# Altium project MOTOR_DRIVER.PrjPcb (part 2 of 2)

## Sheet 3_MOTORES_DC.SchDoc
size Tabloid; SheetNumber: 3; SheetTotal: 5; SPICEModelCacheNJINFHSP: <root> / <DocumentId>NJINFHSP</DocumentId> / <CacheFrame Number="0"> / <Model Name="0603_885012206023_330nf" Kind="CKT"> / <Text>******* / .subckt 0603_885012206023_330nF 1 2 / Rser 1 3 0.0113479919005 / Lser 2 4 4.48567636E-10 / C1 3 4 0.00000033 / Rpar 3 4 1500000000 / .ends 0603_885012206023_330nF</Text> / </Model> / <Model Name="0603_885012206121_330nf" Kind="CKT"> / <Text>******* / .subckt 0603_885012206121_330nF 1 2 / Rser 1 3 0.0116331902783 / Lser 2 4 2.98906197E-10 / C1 3 4 0.00000033 / Rpar 3 4 1500000000 / .ends 0603_885012206121_330nF</Text> / </Model> / <Model Name="0603_885012206008_1nf" Kind="CKT"> / <Text>******* / .subckt 0603_885012206008_1nF 1 2 / Rser 1 3 0.24958 / Lser 2 4 0.00000000040399 / C1 3 4 0.000000001 / Rpar 3 4 10000000000 / .ends 0603_885012206008_1nF</Text> / </Model> / <Model Name="0603_885012206014_10nf" Kind="CKT"> / <Text>******* / .subckt 0603_885012206014_10nF 1 2 / Rser 1 3 0.04641 / Lser 2 4 0.00000000025735 / C1 3 4 0.00000001 / Rpar 3 4 10000000000 / .ends 0603_885012206014_10nF</Text> / </Model> / <Model Name="865080649011_33uf" Kind="CKT"> / <Text>******* / .subckt 865080649011_33uF 1 2 / Rser 1 3 0.64 / Lser 2 4 0.000000003917 / C1 3 4 0.000033 / Rpar 3 4 3030303.03030303 / .ends 865080649011_33uF</Text> / </Model> / </CacheFrame> / </root>
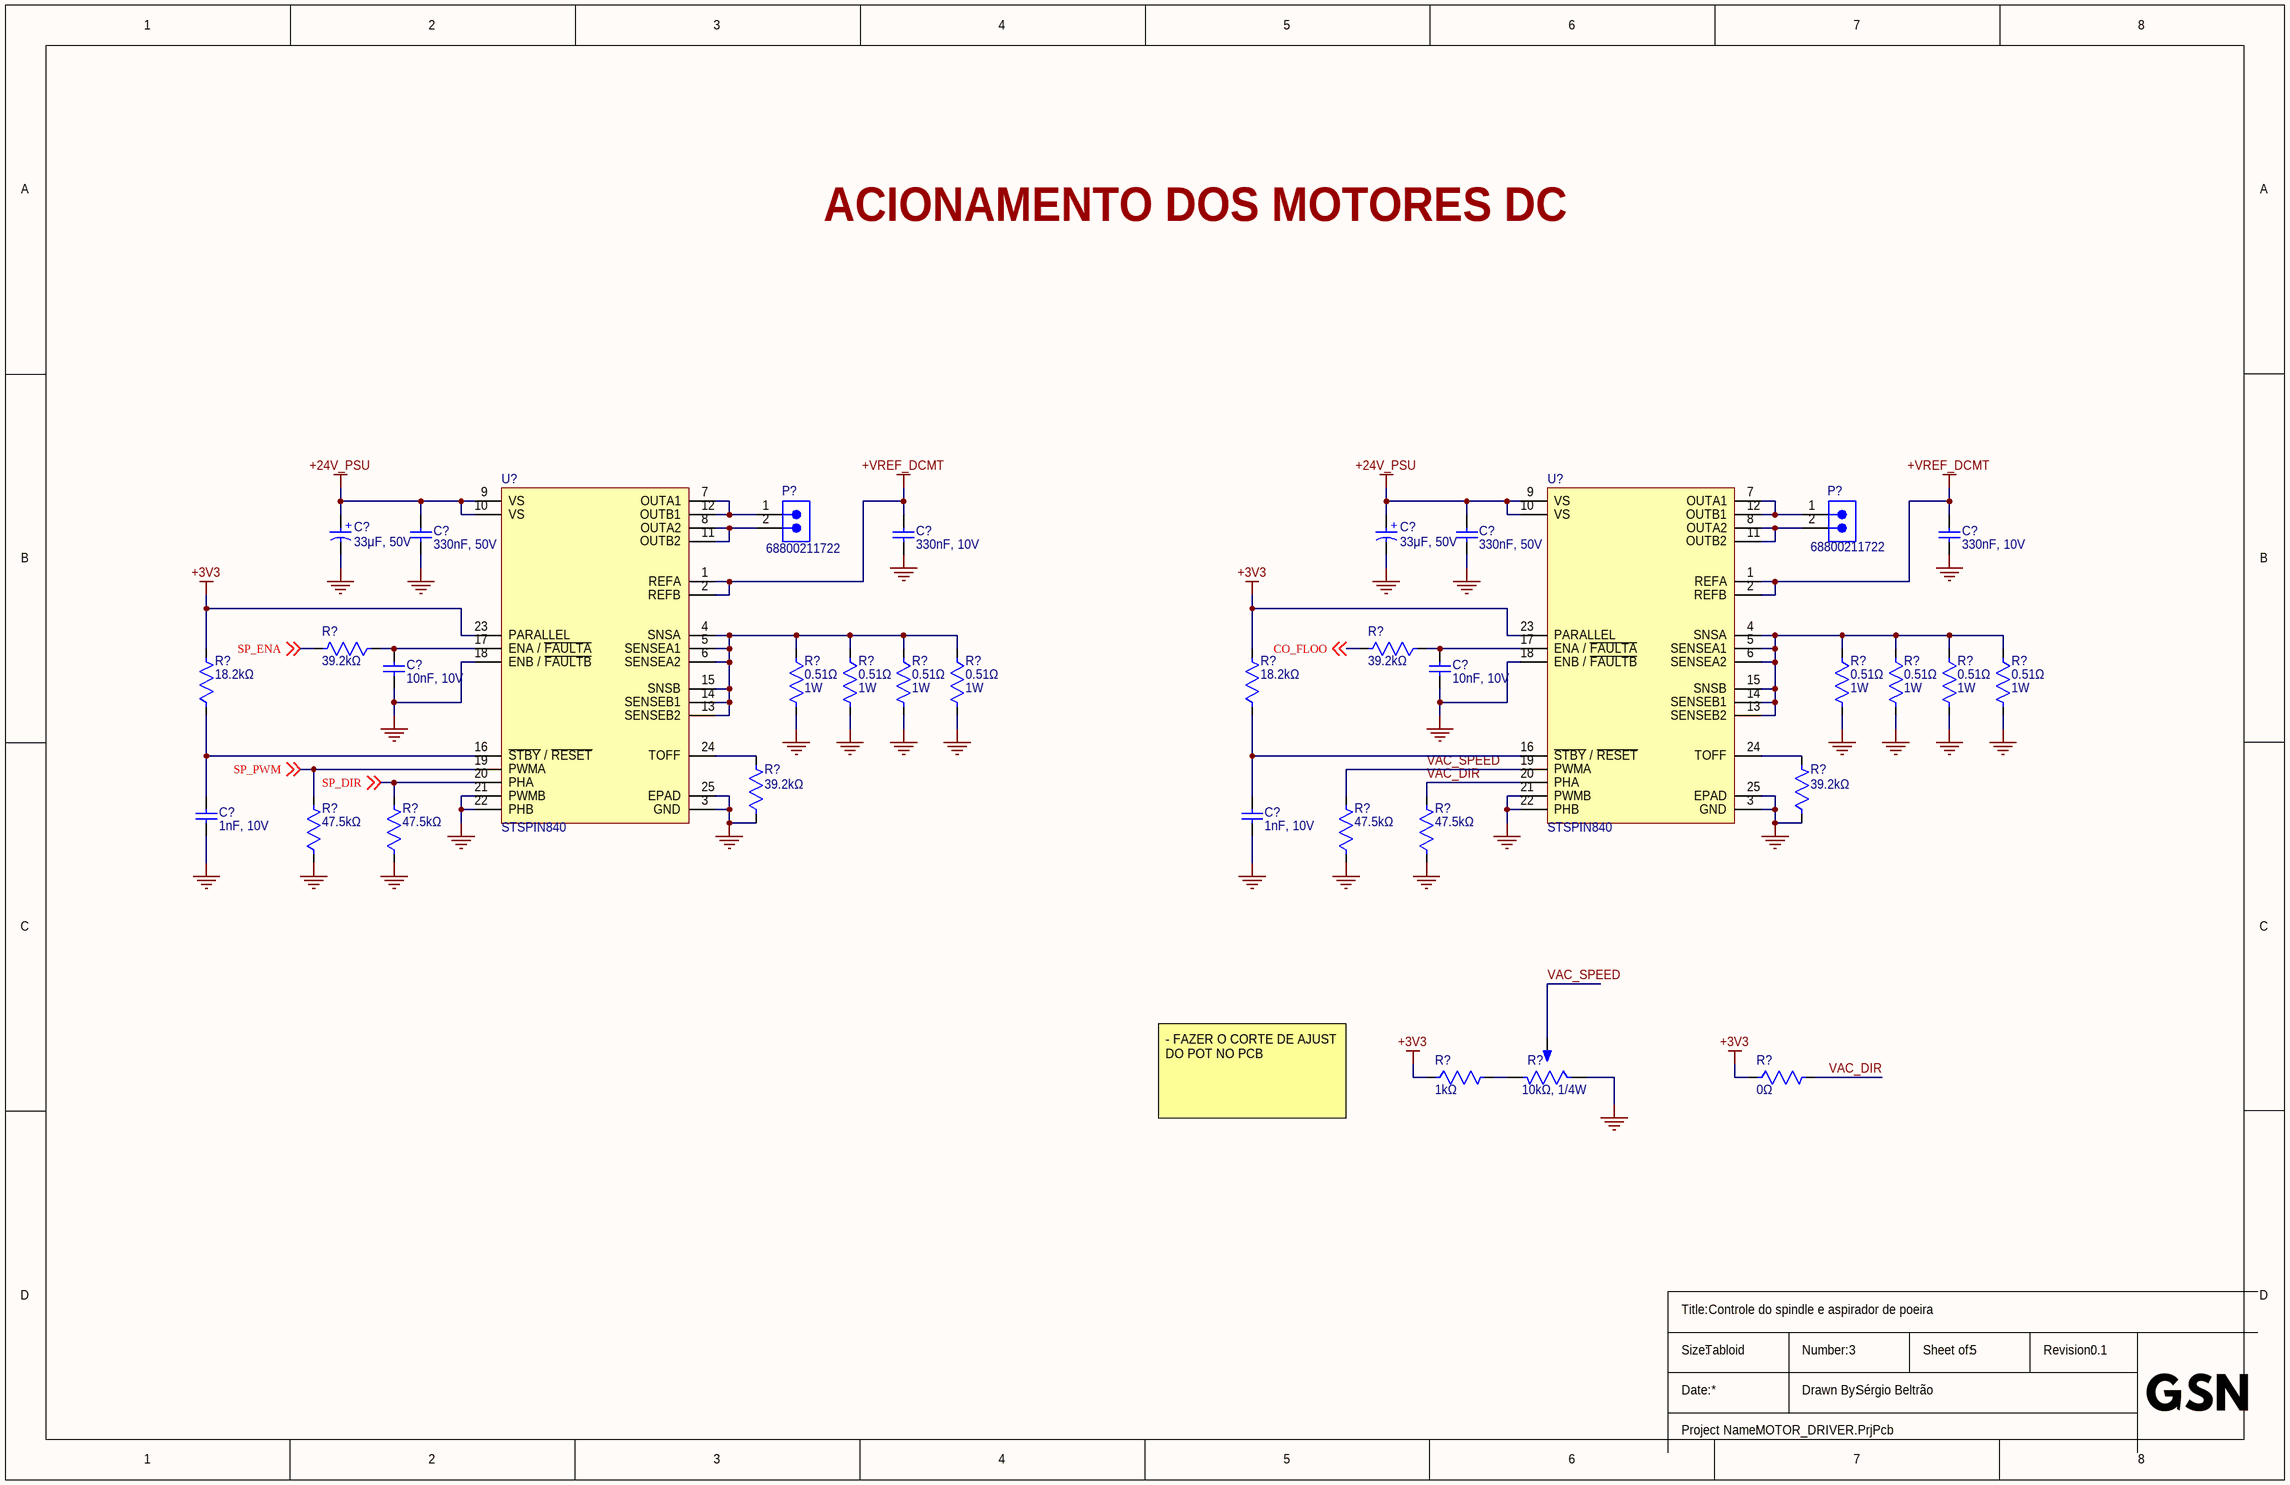
[diagram p2: 3_MOTORES_DC.SchDoc]

### Parts
(Parts that share a designator on the sheet are numbered #1, #2 ... from top to bottom, then left to right.)
C?#21  33μF, 50V  [WCAP-ASLI_D8H6.5]
C?#22  33μF, 50V  [WCAP-ASLI_D8H6.5]
C?#23  330nF, 50V  [WCAP-CSGP_0603_L1.6W0.8H0.8_Reflow]
C?#24  330nF, 10V  [WCAP-CSGP_0603_L1.6W0.8H0.8_Reflow]
C?#25  330nF, 50V  [WCAP-CSGP_0603_L1.6W0.8H0.8_Reflow]
C?#26  330nF, 10V  [WCAP-CSGP_0603_L1.6W0.8H0.8_Reflow]
C?#27  10nF, 10V  [WCAP-CSGP_0603_L1.6W0.8H0.8_Reflow]
C?#28  10nF, 10V  [WCAP-CSGP_0603_L1.6W0.8H0.8_Reflow]
C?#29  1nF, 10V  [WCAP-CSGP_0603_L1.6W0.8H0.8_Reflow]
C?#30  1nF, 10V  [WCAP-CSGP_0603_L1.6W0.8H0.8_Reflow]
P?#10  68800211722  [68800211722]
P?#11  68800211722  [68800211722]
R?#43  39.2kΩ  [0603-REFLOW]
R?#44  0.51Ω  Power Rating: 1W  [2010-REFLOW]
R?#45  0.51Ω  Power Rating: 1W  [2010-REFLOW]
R?#46  0.51Ω  Power Rating: 1W  [2010-REFLOW]
R?#47  0.51Ω  Power Rating: 1W  [2010-REFLOW]
R?#48  39.2kΩ  [0603-REFLOW]
R?#49  0.51Ω  Power Rating: 1W  [2010-REFLOW]
R?#50  0.51Ω  Power Rating: 1W  [2010-REFLOW]
R?#51  0.51Ω  Power Rating: 1W  [2010-REFLOW]
R?#52  0.51Ω  Power Rating: 1W  [2010-REFLOW]
R?#53  18.2kΩ  [0603-REFLOW]
R?#54  18.2kΩ  [0603-REFLOW]
R?#55  39.2kΩ  [0603-REFLOW]
R?#56  39.2kΩ  [0603-REFLOW]
R?#57  47.5kΩ  [0603-REFLOW]
R?#58  47.5kΩ  [0603-REFLOW]
R?#59  47.5kΩ  [0603-REFLOW]
R?#60  47.5kΩ  [0603-REFLOW]
R?#61  1kΩ  [0603-REFLOW]
R?#62  10kΩ, 1/4W  [TRIM-3224W]
R?#63  0Ω  [0603-REFLOW]
U?#7  STSPIN840  [24-TQFPN]
U?#8  STSPIN840  [24-TQFPN]

### Nets
+3V3: R?#53.2 R?#54.2 R?#61.1 R?#63.1 U?#7.23(PARALLEL) U?#8.23(PARALLEL)
+24V_PSU: C?#21.1(P) C?#22.1(P) C?#23.2 C?#25.2 U?#7.9(VS) U?#7.10(VS) U?#8.9(VS) U?#8.10(VS)
+VREF_DCMT: C?#24.2 C?#26.2 U?#7.1(REFA) U?#7.2(REFB) U?#8.1(REFA) U?#8.2(REFB)
GND: C?#21.2(N) C?#22.2(N) C?#23.1 C?#24.1 C?#25.1 C?#26.1 C?#27.1 C?#28.1 C?#29.1 C?#30.1 R?#44.2 R?#45.2 R?#46.2 R?#47.2 R?#49.2 R?#50.2 R?#51.2 R?#52.2 R?#55.1 R?#56.1 R?#57.1 R?#58.1 R?#59.1 R?#60.1 R?#62.1(CCW) U?#7.3(GND) U?#7.18(ENB_/_~{FAULTB}) U?#7.21(PWMB) U?#7.22(PHB) U?#7.25(EPAD) U?#8.3(GND) U?#8.18(ENB_/_~{FAULTB}) U?#8.21(PWMB) U?#8.22(PHB) U?#8.25(EPAD)
CO_FLOO: R?#48.2 ; off-sheet CO_FLOO
SP_DIR: R?#58.2 U?#7.20(PHA) ; off-sheet SP_DIR
SP_ENA: R?#43.2 ; off-sheet SP_ENA
SP_PWM: R?#57.2 U?#7.19(PWMA) ; off-sheet SP_PWM
VAC_DIR: R?#60.2 R?#63.2 U?#8.20(PHA)
VAC_SPEED: R?#59.2 R?#62.2(WIPER) U?#8.19(PWMA)
NetC?#27_2: C?#27.2 R?#43.1 U?#7.17(ENA_/_~{FAULTA})
NetC?#28_2: C?#28.2 R?#48.1 U?#8.17(ENA_/_~{FAULTA})
NetC?#29_2: C?#29.2 R?#53.1 U?#7.16(~{STBY}_/_~{RESET})
NetC?#30_2: C?#30.2 R?#54.1 U?#8.16(~{STBY}_/_~{RESET})
NetP?#10_1: P?#10.1 U?#7.7(OUTA1) U?#7.12(OUTB1)
NetP?#10_2: P?#10.2 U?#7.8(OUTA2) U?#7.11(OUTB2)
NetP?#11_1: P?#11.1 U?#8.7(OUTA1) U?#8.12(OUTB1)
NetP?#11_2: P?#11.2 U?#8.8(OUTA2) U?#8.11(OUTB2)
NetR?#44_1: R?#44.1 R?#45.1 R?#46.1 R?#47.1 U?#7.4(SNSA) U?#7.5(SENSEA1) U?#7.6(SENSEA2) U?#7.13(SENSEB2) U?#7.14(SENSEB1) U?#7.15(SNSB)
NetR?#49_1: R?#49.1 R?#50.1 R?#51.1 R?#52.1 U?#8.4(SNSA) U?#8.5(SENSEA1) U?#8.6(SENSEA2) U?#8.13(SENSEB2) U?#8.14(SENSEB1) U?#8.15(SNSB)
NetR?#55_2: R?#55.2 U?#7.24(TOFF)
NetR?#56_2: R?#56.2 U?#8.24(TOFF)
NetR?#61_2: R?#61.2 R?#62.3(CW)

### Notes on the sheet
- ACIONAMENTO DOS MOTORES DC
- - FAZER O CORTE DE AJUST DO POT NO PCB
- Controle do spindle e aspirador de poeira
- Title:
- Size:
- Tabloid
- Number:
- Sheet of:
- Revision:
- Date:
- Project Name:
- Drawn By:
- (in symbol 865080649011) +

### Library data of the parts
C?#21 C?#22 = 865080649011: WCAP-ASLI Aluminum Electrolytic Capacitor, V-Chip, SMT, 8mm x 6.5mm, 33μF, 50V; Manufacturer: Wurth Elektronik; Capacitance: 33uF; Dissipation Factor: 12%; Endurance: 2000h; Impedance: 700mohm; Leakage Current: 16.5uA; Ripple Current: 200mA; Manufacturer Part Number: 865080649011; Category: Aluminum Electrolytic Capacitors; Match Code: WCAP-ASLI; ComponentLink1Description: Website Link; ComponentLink1URL: https://www.we-online.com/redexpert/article/865080649011?ad; ComponentLink2Description: Datasheet Link; ComponentLink2URL: https://www.we-online.com/redexpert/spec/865080649011?ad; Mount: Surface Mount; Operating Temperature Min: -55degC; Operating Temperature Max: 105degC; Packaging: Tape and Reel; Height: 6.5mm; Diameter: 8mm; Rated Voltage (DC): 50V
C?#23 C?#25 = 885012206121: WCAP-CSGP Multilayer Ceramic Chip Capacitor, General Purpose, size 0603, 330nF, 50V; Manufacturer: Wurth Elektronik; Case/Size Code: 0603; Capacitance Tolerance: +/-10%; Ceramic Type: X7R; Dissipation Factor: 10%; Insulation Resistance: 1.5GΩ; Technical Reference: X7R0603334K050DFCT10000; Manufacturer Part Number: 885012206121; Category: Multilayer Ceramic Chip Capacitors; Match Code: WCAP-CSGP; ComponentLink1Description: Website Link; ComponentLink1URL: https://www.we-online.com/redexpert/article/885012206121?ad; ComponentLink2Description: Datasheet Link; ComponentLink2URL: https://www.we-online.com/redexpert/spec/885012206121?ad; Mount: Surface Mount; Min Operating Temperature: -55°C; Max Operating Temperature: 125°C; Packaging: Tape and Reel; Length: 1.6mm; Width: 0.8mm; Height: 0.8mm; Capacitance: 330nF; Rated Voltage (DC): 50V
C?#24 C?#26 = 885012206023: WCAP-CSGP Multilayer Ceramic Chip Capacitor, General Purpose, size 0603, 330nF, 10V; Manufacturer: Wurth Elektronik; Case/Size Code: 0603; Capacitance Tolerance: +/-10%; Ceramic Type: X7R; Dissipation Factor: 10%; Insulation Resistance: 1.5GΩ; Technical Reference: X7R0603334K010DFCT10000; Manufacturer Part Number: 885012206023; Category: Multilayer Ceramic Chip Capacitors; Match Code: WCAP-CSGP; ComponentLink1Description: Website Link; ComponentLink1URL: https://www.we-online.com/redexpert/article/885012206023?ad; ComponentLink2Description: Datasheet Link; ComponentLink2URL: https://www.we-online.com/redexpert/spec/885012206023?ad; Mount: Surface Mount; Min Operating Temperature: -55°C; Max Operating Temperature: 125°C; Packaging: Tape and Reel; Length: 1.6mm; Width: 0.8mm; Height: 0.8mm; Capacitance: 330nF; Rated Voltage (DC): 10V
C?#27 C?#28 = 885012206014: WCAP-CSGP Multilayer Ceramic Chip Capacitor, General Purpose, size 0603, 10nF, 10V; Manufacturer: Wurth Elektronik; Case/Size Code: 0603; Capacitance Tolerance: +/-10%; Ceramic Type: X7R; Dissipation Factor: 5%; Insulation Resistance: 10GΩ; Technical Reference: X7R0603103K010DFCT10000; Manufacturer Part Number: 885012206014; Category: Multilayer Ceramic Chip Capacitors; Match Code: WCAP-CSGP; ComponentLink1Description: Website Link; ComponentLink1URL: https://www.we-online.com/redexpert/article/885012206014?ad; ComponentLink2Description: Datasheet Link; ComponentLink2URL: https://www.we-online.com/redexpert/spec/885012206014?ad; Mount: Surface Mount; Min Operating Temperature: -55°C; Max Operating Temperature: 125°C; Packaging: Tape and Reel; Length: 1.6mm; Width: 0.8mm; Height: 0.8mm; Capacitance: 10nF; Rated Voltage (DC): 10V
C?#29 C?#30 = 885012206008: WCAP-CSGP Multilayer Ceramic Chip Capacitor, General Purpose, size 0603, 1nF, 10V; Manufacturer: Wurth Elektronik; Case/Size Code: 0603; Capacitance Tolerance: +/-10%; Ceramic Type: X7R; Dissipation Factor: 5%; Insulation Resistance: 10GΩ; Technical Reference: X7R0603102K010DFCT10000; Manufacturer Part Number: 885012206008; Category: Multilayer Ceramic Chip Capacitors; Match Code: WCAP-CSGP; ComponentLink1Description: Website Link; ComponentLink1URL: https://www.we-online.com/redexpert/article/885012206008?ad; ComponentLink2Description: Datasheet Link; ComponentLink2URL: https://www.we-online.com/redexpert/spec/885012206008?ad; Mount: Surface Mount; Min Operating Temperature: -55°C; Max Operating Temperature: 125°C; Packaging: Tape and Reel; Length: 1.6mm; Width: 0.8mm; Height: 0.8mm; Capacitance: 1nF; Rated Voltage (DC): 10V
P?#10 P?#11 = 68800211722: WR-WTB “J” Type THT Male Horizontal Shrouded Header, pitch 2.5 mm, 2 pins; Manufacturer: Wurth Elektronik; Contact Resistance: 20 mohm; Rated Current: 3 A; Working Voltage: 250 V(AC); Withstanding Voltage: 800 V(AC); Manufacturer Part Number: 68800211722; Category: Wire-to-Board Connector; Match Code: WR-WTB; ComponentLink1Description: Website Link; ComponentLink1URL: https://www.we-online.com/redexpert/article/68800211722?ad; ComponentLink2Description: Datasheet Link; ComponentLink2URL: https://www.we-online.com/redexpert/spec/68800211722?ad; Mount: Through Hole; Operating Temperature Min: -25degC; Operating Temperature Max: 85degC; Packaging: Bag; Length: 7.5 mm; Width: 8.3 mm; Height: 4.2 mm; Gender: Male; Number of Pins: 2; Number of Rows: 1; Orientation: Horizontal; Lead Pitch: 2.5 mm
R?#43 R?#48 R?#55 R?#56 = RC0603FR-0739K2L: RES 39.2K OHM 1% 1/10W 0603; Manufacturer: Yageo Group; Max Power Dissipation: 100mW; Temperature Coefficient: ±200ppm/°C; Voltage Rating (AC): 50V; Voltage Rating: 75V; Supplier Part Number: 311-39.2KHRCT-ND; Manufacturer Part Number: RC0603FR-0739K2L; Value: 39.2kΩ; Case Code (Imperial): 0603; Case Code (Metric): 1608; Case/Package: 0603; Category: Chip SMD Resistors; China RoHS: Non-Compliant; Composition: Thick Film; Contact Plating: Tin; Depth: 800µm; Features: Moisture Resistant; Height: 450µm; Lead Free: Lead Free; Length: 1.6mm; Lifecycle Status: Production; Max Operating Temperature: 155°C; Military Standard: Not; Min Operating Temperature: -55°C; Mounting Technology: Surface Mount; Number of Terminals: 2; Number of Terminations: 2; Packaging: Tape & Reel; Power Dissipation: 100mW; Power Rating: 100mW; Radiation Hardening: No; REACH SVHC: Yes; RoHS: Compliant; Supplier: DigiKey; Termination: SMD/SMT; Tolerance: 1%; Component Link Description: https://www.yageogroup.com/content/datasheet/asset/file/PYU-RC_GROUP_51_ROHS_L; Component Link URL: https://www.yageogroup.com/content/datasheet/asset/file/PYU-RC_GROUP_51_ROHS_L; Datasheet: https://www.yageogroup.com/content/datasheet/asset/file/PYU-RC_GROUP_51_ROHS_L; Voltage Rating (DC): 50V; Weight: 2.012816mg; Width: 800µm; Working Voltage: 75V
R?#44-R?#47 R?#49-R?#52 = RCWE2010R510FKEA: RES 0.51 OHM 1% 1W 2010; Manufacturer: Vishay; Value: 510mΩ; Temperature Coefficient: 100ppm/°C; Working Voltage: 714.1mV; Supplier: DigiKey; Supplier Part Number: RCWE.51GCT-ND; Manufacturer Part Number: RCWE2010R510FKEA; RoHS: Compliant; Category: Chip SMD Resistors; Stock: 6435; Pricing: 1=0.65, 10=0.417, 25=0.3544, 50=0.3156, 100=0.2824, 250=0.24596, 500=0.22314, 1000=0.20376 (USD); Case/Package: 2010; Case Code (Imperial): 2010; Case Code (Metric): 5025; China RoHS: Non-Compliant; Composition: Thick Film; Contact Plating: Tin; Features: Automotive AEC-Q200, Moisture Resistant; Height: 600µm; Length: 5.0038mm; Lifecycle Status: Production; Max Operating Temperature: 155°C; Max Power Dissipation: 1W; Min Operating Temperature: -55°C; Mounting Technology: Surface Mount; Pins: 2; Number of Terminals: 2; Number of Terminations: 2; Power Dissipation: 1W; Radiation Hardening: No; REACH SVHC: Yes; Schedule B: 8533210045, 8533210045|8533210045|8533210045|8533210045|8533210045; Termination: SMD/SMT; Tolerance: 1%; Width: 2.5mm; ComponentLink1URL: https://datasheet.octopart.com:443/RCWE2010R510FKEA-Vishay-datasheet-170667730.pdf?src-supplier=IHS; ComponentLink1Description: https://datasheet.octopart.com:443/RCWE2010R510FKEA-Vishay-datasheet-170667730.pdf?src-supplier=IHS; ComponentLink2URL: https://datasheet.octopart.com:443/RCWE2010R510FKEA-Vishay-datasheet-78835242.pdf?src-supplier=Newark; ComponentLink2Description: https://datasheet.octopart.com:443/RCWE2010R510FKEA-Vishay-datasheet-78835242.pdf?src-supplier=Newark; ComponentLink3URL: https://datasheet.octopart.com:443/RCWE2010R510FKEA-Vishay-datasheet-10025643.pdf?src-supplier=element14+APAC; ComponentLink3Description: https://datasheet.octopart.com:443/RCWE2010R510FKEA-Vishay-datasheet-10025643.pdf?src-supplier=element14+APAC; ComponentLink4URL: http://sigma.octopart.com:80/rohs_statement/Vishay-company-15.pdf?src-supplier=Compliance+Statements; ComponentLink4Description: http://sigma.octopart.com:80/rohs_statement/Vishay-company-15.pdf?src-supplier=Compliance+Statements
R?#53 R?#54 = RC0603FR-0718K2L: RES 18.2K OHM 1% 1/10W 0603; Manufacturer: Yageo Group; Max Power Dissipation: 100mW; Temperature Coefficient: ±200ppm/°C; Voltage Rating (AC): 50V; Voltage Rating: 75V; Supplier Part Number: 311-18.2KHRCT-ND; Manufacturer Part Number: RC0603FR-0718K2L; Value: 18.2kΩ; Case Code (Imperial): 0603; Case Code (Metric): 1608; Case/Package: 0603; Category: Chip SMD Resistors; China RoHS: Non-Compliant; Composition: Thick Film; Contact Plating: Tin; Depth: 800µm; Features: Moisture Resistant; Height: 450µm; Lead Free: Lead Free; Length: 1.6mm; Lifecycle Status: Production; Max Operating Temperature: 155°C; Military Standard: Not; Min Operating Temperature: -55°C; Mounting Technology: Surface Mount; Number of Terminals: 2; Number of Terminations: 2; Packaging: Tape & Reel; Power Dissipation: 100mW; Power Rating: 100mW; Radiation Hardening: No; REACH SVHC: Yes; RoHS: Compliant; Supplier: DigiKey; Termination: SMD/SMT; Tolerance: 1%; Component Link Description: https://www.yageogroup.com/content/datasheet/asset/file/PYU-RC_GROUP_51_ROHS_L; Component Link URL: https://www.yageogroup.com/content/datasheet/asset/file/PYU-RC_GROUP_51_ROHS_L; Datasheet: https://www.yageogroup.com/content/datasheet/asset/file/PYU-RC_GROUP_51_ROHS_L; Voltage Rating (DC): 50V; Weight: 2.012816mg; Width: 800µm; Working Voltage: 75V
R?#57-R?#60 = RC0603FR-0747K5L: RES 47.5K OHM 1% 1/10W 0603; Manufacturer: Yageo Group; Max Power Dissipation: 100mW; Temperature Coefficient: ±200ppm/°C; Voltage Rating (AC): 50V; Voltage Rating: 75V; Supplier Part Number: 311-47.5KHRCT-ND; Manufacturer Part Number: RC0603FR-0747K5L; Value: 47.5kΩ; Case Code (Imperial): 0603; Case Code (Metric): 1608; Case/Package: 0603; Category: Chip SMD Resistors; China RoHS: Non-Compliant; Composition: Thick Film; Contact Plating: Tin; Depth: 800µm; Features: Moisture Resistant; Height: 450µm; Lead Free: Lead Free; Length: 1.6mm; Lifecycle Status: Production; Max Operating Temperature: 155°C; Military Standard: Not; Min Operating Temperature: -55°C; Mounting Technology: Surface Mount; Number of Terminals: 2; Number of Terminations: 2; Packaging: Tape & Reel; Power Dissipation: 100mW; Power Rating: 100mW; Radiation Hardening: No; REACH SVHC: Yes; RoHS: Compliant; Supplier: DigiKey; Termination: SMD/SMT; Tolerance: 1%; Component Link Description: https://www.yageogroup.com/content/datasheet/asset/file/PYU-RC_GROUP_51_ROHS_L; Component Link URL: https://www.yageogroup.com/content/datasheet/asset/file/PYU-RC_GROUP_51_ROHS_L; Datasheet: https://www.yageogroup.com/content/datasheet/asset/file/PYU-RC_GROUP_51_ROHS_L; Voltage Rating (DC): 50V; Weight: 2.012816mg; Width: 800µm; Working Voltage: 75V
R?#61 = RC0603FR-071KL: RES 1K OHM 1% 1/10W 0603; Manufacturer: Yageo Group; Max Power Dissipation: 100mW; Temperature Coefficient: ±200ppm/°C; Voltage Rating (AC): 50V; Voltage Rating: 75V; Supplier Part Number: 311-1.00KHRCT-ND; Manufacturer Part Number: RC0603FR-071KL; Value: 1kΩ; Case Code (Imperial): 0603; Case Code (Metric): 1608; Case/Package: 0603; Category: Chip SMD Resistors; China RoHS: Non-Compliant; Composition: Thick Film; Contact Plating: Tin; Depth: 800µm; Features: Moisture Resistant; Height: 450µm; Lead Free: Lead Free; Length: 1.6mm; Lifecycle Status: Production; Max Operating Temperature: 155°C; Military Standard: Not; Min Operating Temperature: -55°C; Mounting Technology: Surface Mount; Number of Terminals: 2; Number of Terminations: 2; Packaging: Tape & Reel; Power Dissipation: 100mW; Power Rating: 100mW; Radiation Hardening: No; REACH SVHC: Yes; RoHS: Compliant; Supplier: DigiKey; Termination: SMD/SMT; Tolerance: 1%; Component Link Description: https://www.yageogroup.com/content/datasheet/asset/file/PYU-RC_GROUP_51_ROHS_L; Component Link URL: https://www.yageogroup.com/content/datasheet/asset/file/PYU-RC_GROUP_51_ROHS_L; Datasheet: https://www.yageogroup.com/content/datasheet/asset/file/PYU-RC_GROUP_51_ROHS_L; Voltage Rating (DC): 50V; Weight: 2.012816mg; Width: 800µm; Working Voltage: 75V
R?#62 = 3224W-1-103G: TRIMMER 10K OHM 0.25W J LEAD TOP; Manufacturer: Bourns; Max Power Dissipation: 250mW; Number of Turns: 12; Temperature Coefficient: 100ppm/°C; Tolerance: 10%; Working Voltage: 300V; Supplier: DigiKey; Supplier Part Number: 3224W-1-103GCT-ND; Manufacturer Part Number: 3224W-1-103G; RoHS: Compliant; Category: Variable Resistors and Potentiometers; Stock: 792; Pricing: 1=3.93, 10=3.271, 25=3.038, 50=2.8722, 100=2.7147, 250=2.51884, 500=2.3796 (USD); Composition: Cermet; Depth: 3.9mm; Height: 5.1mm; Length: 4.8mm; Lifecycle Status: Production; Max Operating Temperature: 150°C; Military Standard: Not; Min Operating Temperature: -65°C; Mounting Technology: Surface Mount; Number of Terminals: 3; Packaging: Tape & Reel (TR); Power Rating: 250mW; REACH SVHC: No; Value: 10kΩ; Termination: SMD/SMT; Width: 3.5mm; ComponentLink1URL: https://datasheet.octopart.com:443/3224W-1-103G-Bourns-datasheet-182141393.pdf?src-supplier=IHS; ComponentLink1Description: https://datasheet.octopart.com:443/3224W-1-103G-Bourns-datasheet-182141393.pdf?src-supplier=IHS; ComponentLink2URL: https://datasheet.octopart.com:443/3224W-1-103G-Bourns-datasheet-156011607.pdf?src-supplier=element14+APAC; ComponentLink2Description: https://datasheet.octopart.com:443/3224W-1-103G-Bourns-datasheet-156011607.pdf?src-supplier=element14+APAC; ComponentLink3URL: https://datasheet.octopart.com:443/3224W-1-103G-Bourns-datasheet-64275176.pdf?src-supplier=Master+Electronics; ComponentLink3Description: https://datasheet.octopart.com:443/3224W-1-103G-Bourns-datasheet-64275176.pdf?src-supplier=Master+Electronics; ComponentLink4URL: https://datasheet.octopart.com:443/3224W-1-103G-Bourns-datasheet-11533694.pdf?src-supplier=Arrow+Electronics; ComponentLink4Description: https://datasheet.octopart.com:443/3224W-1-103G-Bourns-datasheet-11533694.pdf?src-supplier=Arrow+Electronics; ComponentLink5URL: http://sigma.octopart.com:80/conflict_mineral_statement/Bourns-company-36.pdf?src-supplier=Compliance+Statements; ComponentLink5Description: http://sigma.octopart.com:80/conflict_mineral_statement/Bourns-company-36.pdf?src-supplier=Compliance+Statements
R?#63 = RC0603FR-070RL: RES 0 OHM 1% 1/10W 0603; Manufacturer: Yageo Group; Max Power Dissipation: 100mW; Temperature Coefficient: ±200ppm/°C; Voltage Rating (AC): 50V; Voltage Rating: 75V; Supplier Part Number: 311-0.0HRCT-ND; Manufacturer Part Number: RC0603FR-070RL; Value: 0Ω; Case Code (Imperial): 0603; Case Code (Metric): 1608; Case/Package: 0603; Category: Chip SMD Resistors; China RoHS: Non-Compliant; Composition: Thick Film; Contact Plating: Tin; Depth: 800µm; Features: Moisture Resistant; Height: 450µm; Lead Free: Lead Free; Length: 1.6mm; Lifecycle Status: Production; Max Operating Temperature: 155°C; Military Standard: Not; Min Operating Temperature: -55°C; Mounting Technology: Surface Mount; Number of Terminals: 2; Number of Terminations: 2; Packaging: Tape & Reel; Power Dissipation: 100mW; Power Rating: 100mW; Radiation Hardening: No; REACH SVHC: Yes; RoHS: Compliant; Supplier: DigiKey; Termination: SMD/SMT; Tolerance: 1%; Component Link Description: https://www.yageogroup.com/content/datasheet/asset/file/PYU-RC_GROUP_51_ROHS_L; Component Link URL: https://www.yageogroup.com/content/datasheet/asset/file/PYU-RC_GROUP_51_ROHS_L; Datasheet: https://www.yageogroup.com/content/datasheet/asset/file/PYU-RC_GROUP_51_ROHS_L; Voltage Rating (DC): 50V; Weight: 2.012816mg; Width: 800µm; Working Voltage: 75V
U?#7 U?#8 = STSPIN840: IC MOTOR DRIVER 7V-45V 24TQFPN; Manufacturer: STMicroelectronics; Drain to Source Resistance: 500mΩ; Interface: Parallel; Max Output current: 1.5A; Max Supply Voltage: 45V; Min Supply Voltage: 7V; Number of Circuits: 1; Operating Supply Voltage: 36V; Output Voltage: 48V; Supplier: DigiKey; Supplier Part Number: 497-18119-1-ND; Manufacturer Part Number: STSPIN840; RoHS: Compliant; Category: Motor Drivers; Stock: 9342; Pricing: 1=2.95, 10=2.208, 25=2.022, 100=1.8174, 250=1.71984, 500=1.66102, 1000=1.61261 (USD); China RoHS: Compliant; Height - Seated (Max): 1.1mm; Length: 4mm; Lifecycle Status: Production; Max Operating Temperature: 150°C; Min Operating Temperature: -40°C; Number of Terminals: 24; Output Current: 1.5A; REACH SVHC: Yes; Schedule B: 8542390000, 8542390000|8542390000|8542390000|8542390000|8542390000; Terminal Pitch: 500µm; Width: 4mm; ComponentLink1URL: https://datasheet.octopart.com:443/STSPIN840-STMicroelectronics-datasheet-116891059.pdf?src-supplier=ODG+(Origin+Data+Global); ComponentLink1Description: https://datasheet.octopart.com:443/STSPIN840-STMicroelectronics-datasheet-116891059.pdf?src-supplier=ODG+(Origin+Data+Global)

## Sheet 5_IO_EXTERNOS.SchDoc
size Tabloid; SheetNumber: 4; SheetTotal: 4; SPICEModelCacheXJOKVXOX: <root> / <DocumentId>XJOKVXOX</DocumentId> / </root>
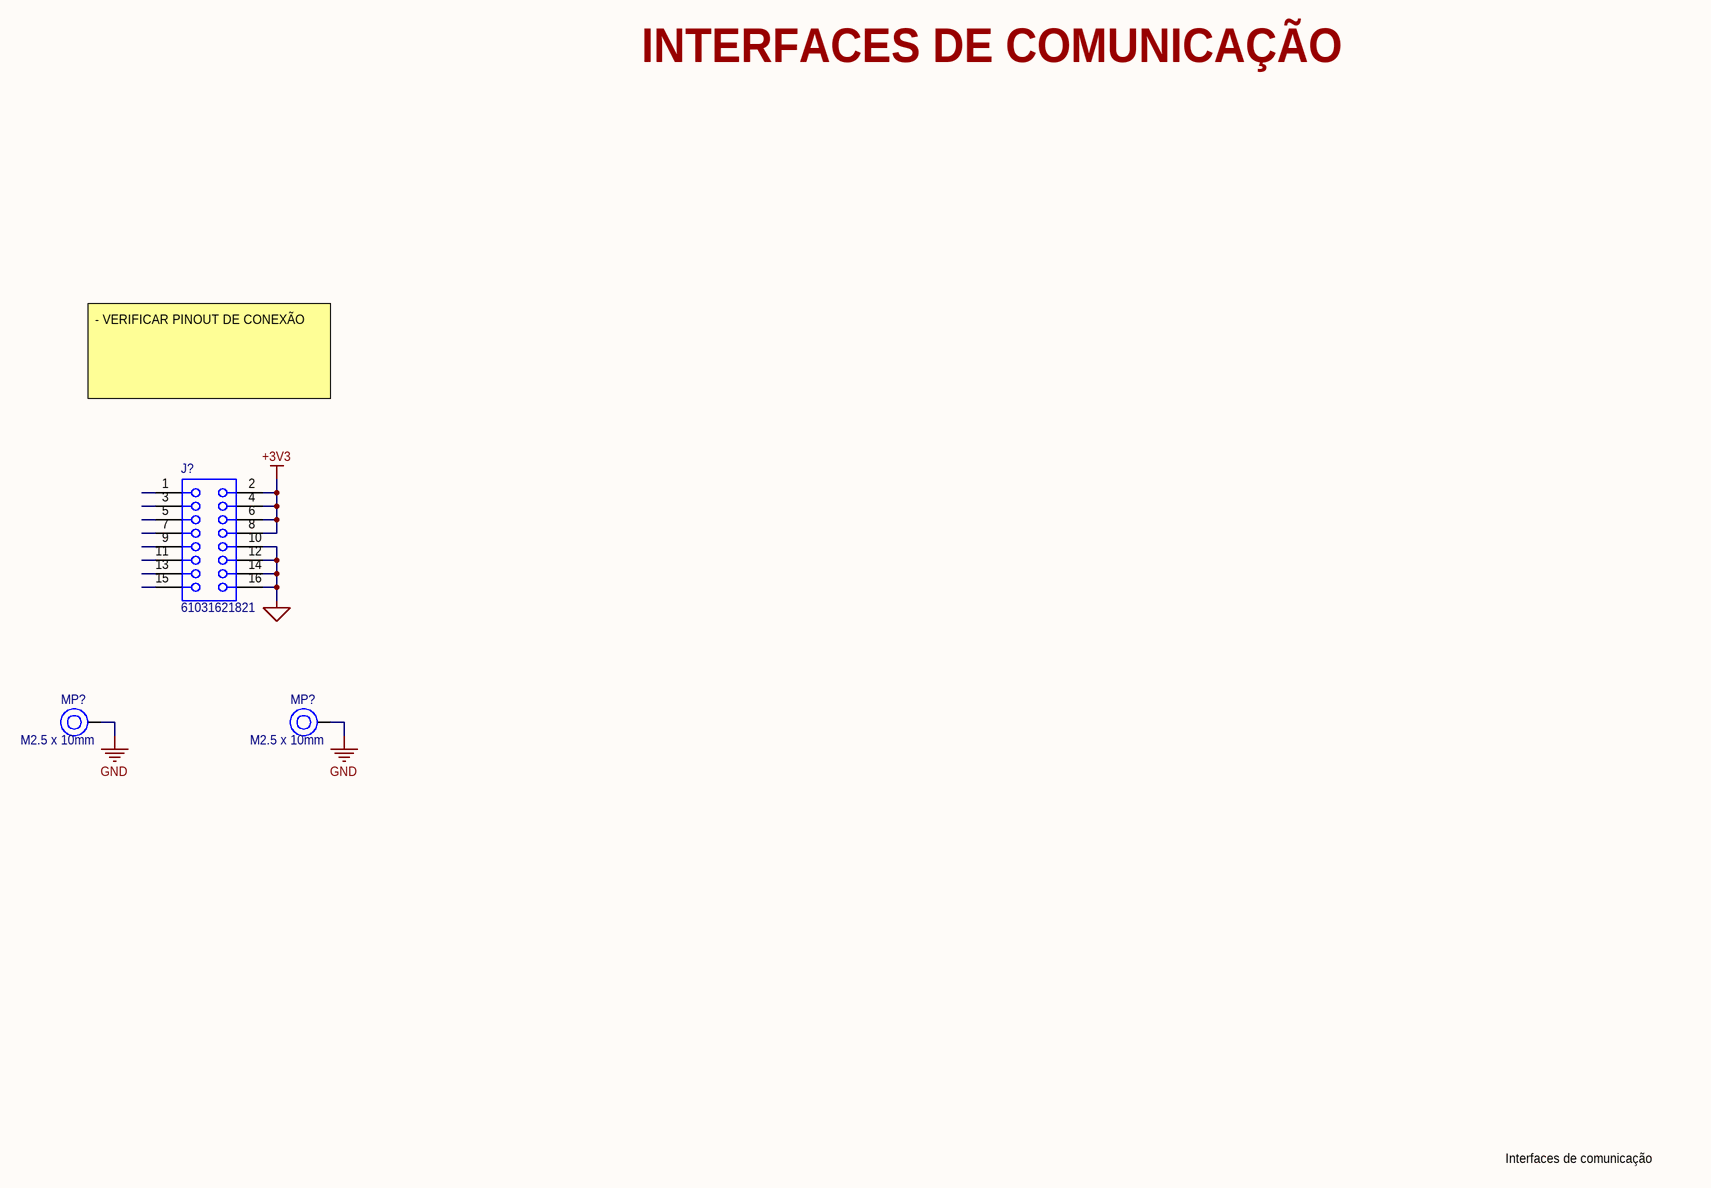
[diagram p3: 5_IO_EXTERNOS.SchDoc]

### Parts
(Parts that share a designator on the sheet are numbered #1, #2 ... from top to bottom, then left to right.)
J?#2  61031621821  [61031621821]
MP?#1  M2.5 x 10mm  [9774100151]
MP?#2  M2.5 x 10mm  [9774100151]

### Nets
+3V3: J?#2.2 J?#2.4 J?#2.6 J?#2.8
GND: MP?#1.1 MP?#2.1
GND_ISO: J?#2.10 J?#2.12 J?#2.14 J?#2.16

Not connected (* = marked no-connect by the designer): J?#2 1 3 5 7 9 11 13 15

### Notes on the sheet
- INTERFACES DE COMUNICAÇÃO
- - VERIFICAR PINOUT DE CONEXÃO
- Interfaces de comunicação
- Title:
- Size:
- Tabloid
- Number:
- Sheet of:
- Revision:
- Date:
- Project Name:
- Drawn By:

### Library data of the parts
J?#2 = 61031621821: WR-PHD Socket Header, SMT, Vertical, pitch 2.54mm, 2 Row, 16P; Manufacturer: Wurth Elektronik; Contact Resistance: 20mOhm; Rated Current: 3A; Working Voltage: 250V; Withstanding Voltage: 600V; Manufacturer Part Number: 61031621821; Category: Board-to-Board Connectors; Match Code: WR-PHD; ComponentLink1Description: Website Link; ComponentLink1URL: https://www.we-online.com/redexpert/article/61031621821?ad; ComponentLink2Description: Datasheet Link; ComponentLink2URL: https://www.we-online.com/redexpert/spec/61031621821?ad; Mount: Surface Mount; Operating Temperature Min: -40degC; Operating Temperature Max: 105degC; Packaging: Tape and Reel; Gender: Socket Header; Number of Pins: 16; Number of Rows: 2; Orientation: Vertical; Lead Pitch: 2.54mm
MP?#1 MP?#2 = 9774100151R: WA-SMSI SMT Steel Spacer with internal Thread, OD 5.1mm, M2.5 x 10mm; Manufacturer: Wurth Elektronik; Inside Diameter: 3.5mm; Surface: Tin; Manufacturer Part Number: 9774100151R; Category: SMT Spacers; Match Code: WA-SMSI; ComponentLink1Description: Website Link; ComponentLink1URL: https://www.we-online.com/redexpert/article/9774100151R?ad; ComponentLink2Description: Datasheet Link; ComponentLink2URL: https://www.we-online.com/redexpert/spec/9774100151R?ad; Mount: Surface Mount; Operating Temperature Min: -55degC; Operating Temperature Max: 150degC; Packaging: Tape and Reel; Height: 10mm; Material: Steel; Outside Diameter: 5.1mm; Thread Size: M2.5

## Nets that join several sheets
+3V3: 1_ENTRADA_DE_ALIMENTACAO (8 pins), 2_MOTORES_DE_PASSO (7 pins), 3_MOTORES_DC (6 pins), 5_IO_EXTERNOS (J?#2.2 J?#2.4 J?#2.6 J?#2.8)
+24V_PSU: 1_ENTRADA_DE_ALIMENTACAO (15 pins), 2_MOTORES_DE_PASSO (12 pins), 3_MOTORES_DC (8 pins)
+VREF_DCMT: 1_ENTRADA_DE_ALIMENTACAO (R?#10.2 R?#11.1), 3_MOTORES_DC (6 pins)
GND: 1_ENTRADA_DE_ALIMENTACAO (26 pins), 2_MOTORES_DE_PASSO (49 pins), 3_MOTORES_DC (35 pins), 5_IO_EXTERNOS (MP?#1.1 MP?#2.1)